# Altium schematic sheet 100068622_power_supplies.SchDoc
size 863 x 558 mm; SheetNumber: 5; SheetTotal: 6
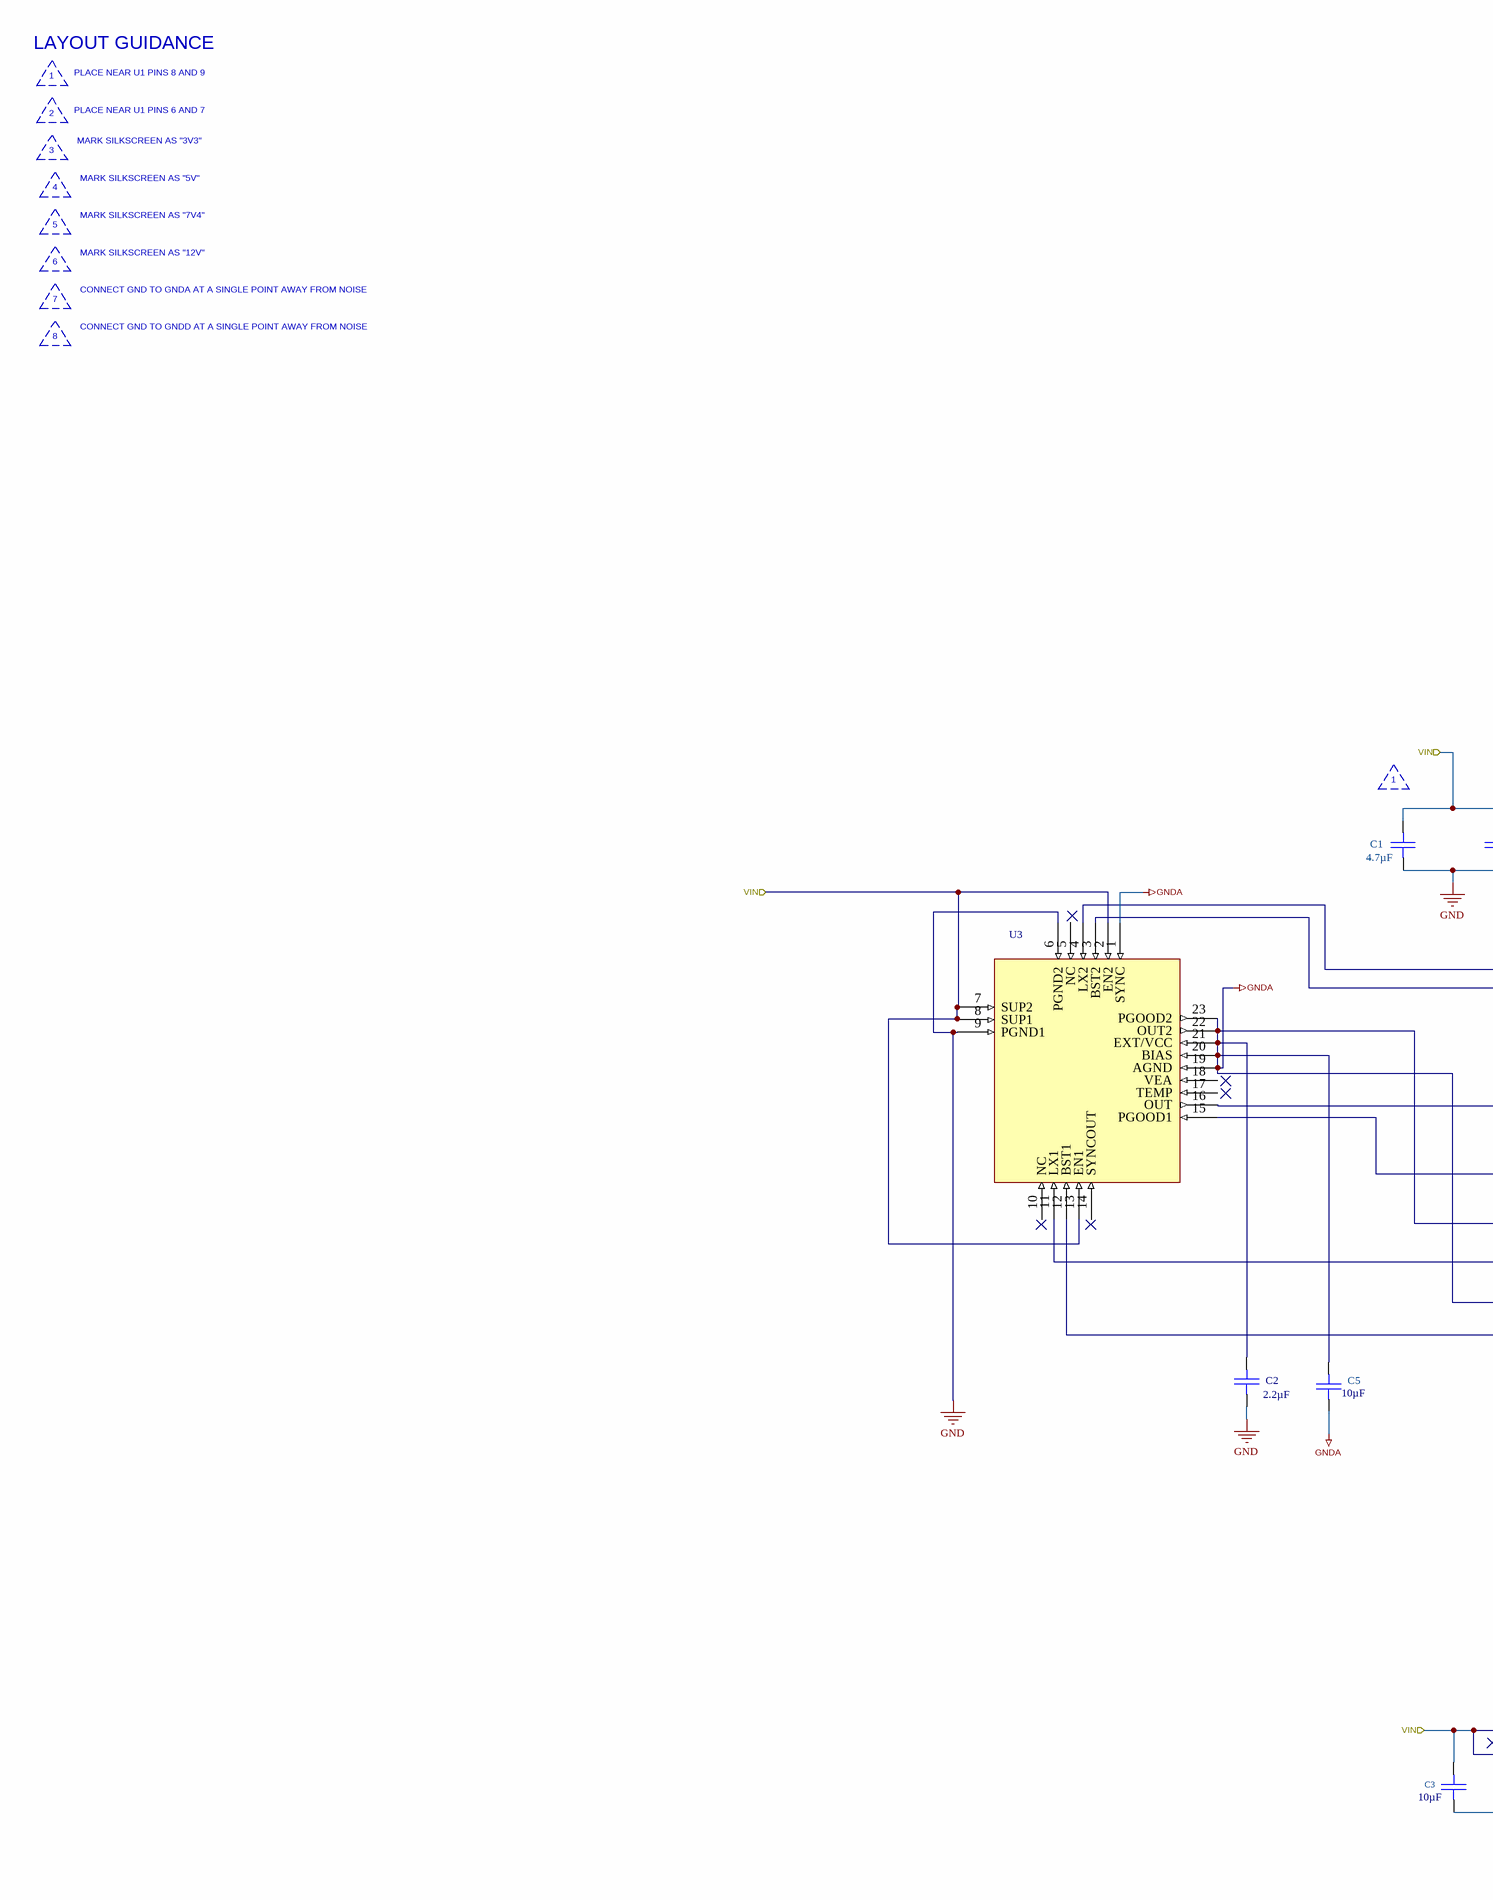
[diagram p0: 100068622_power_supplies.SchDoc, left]
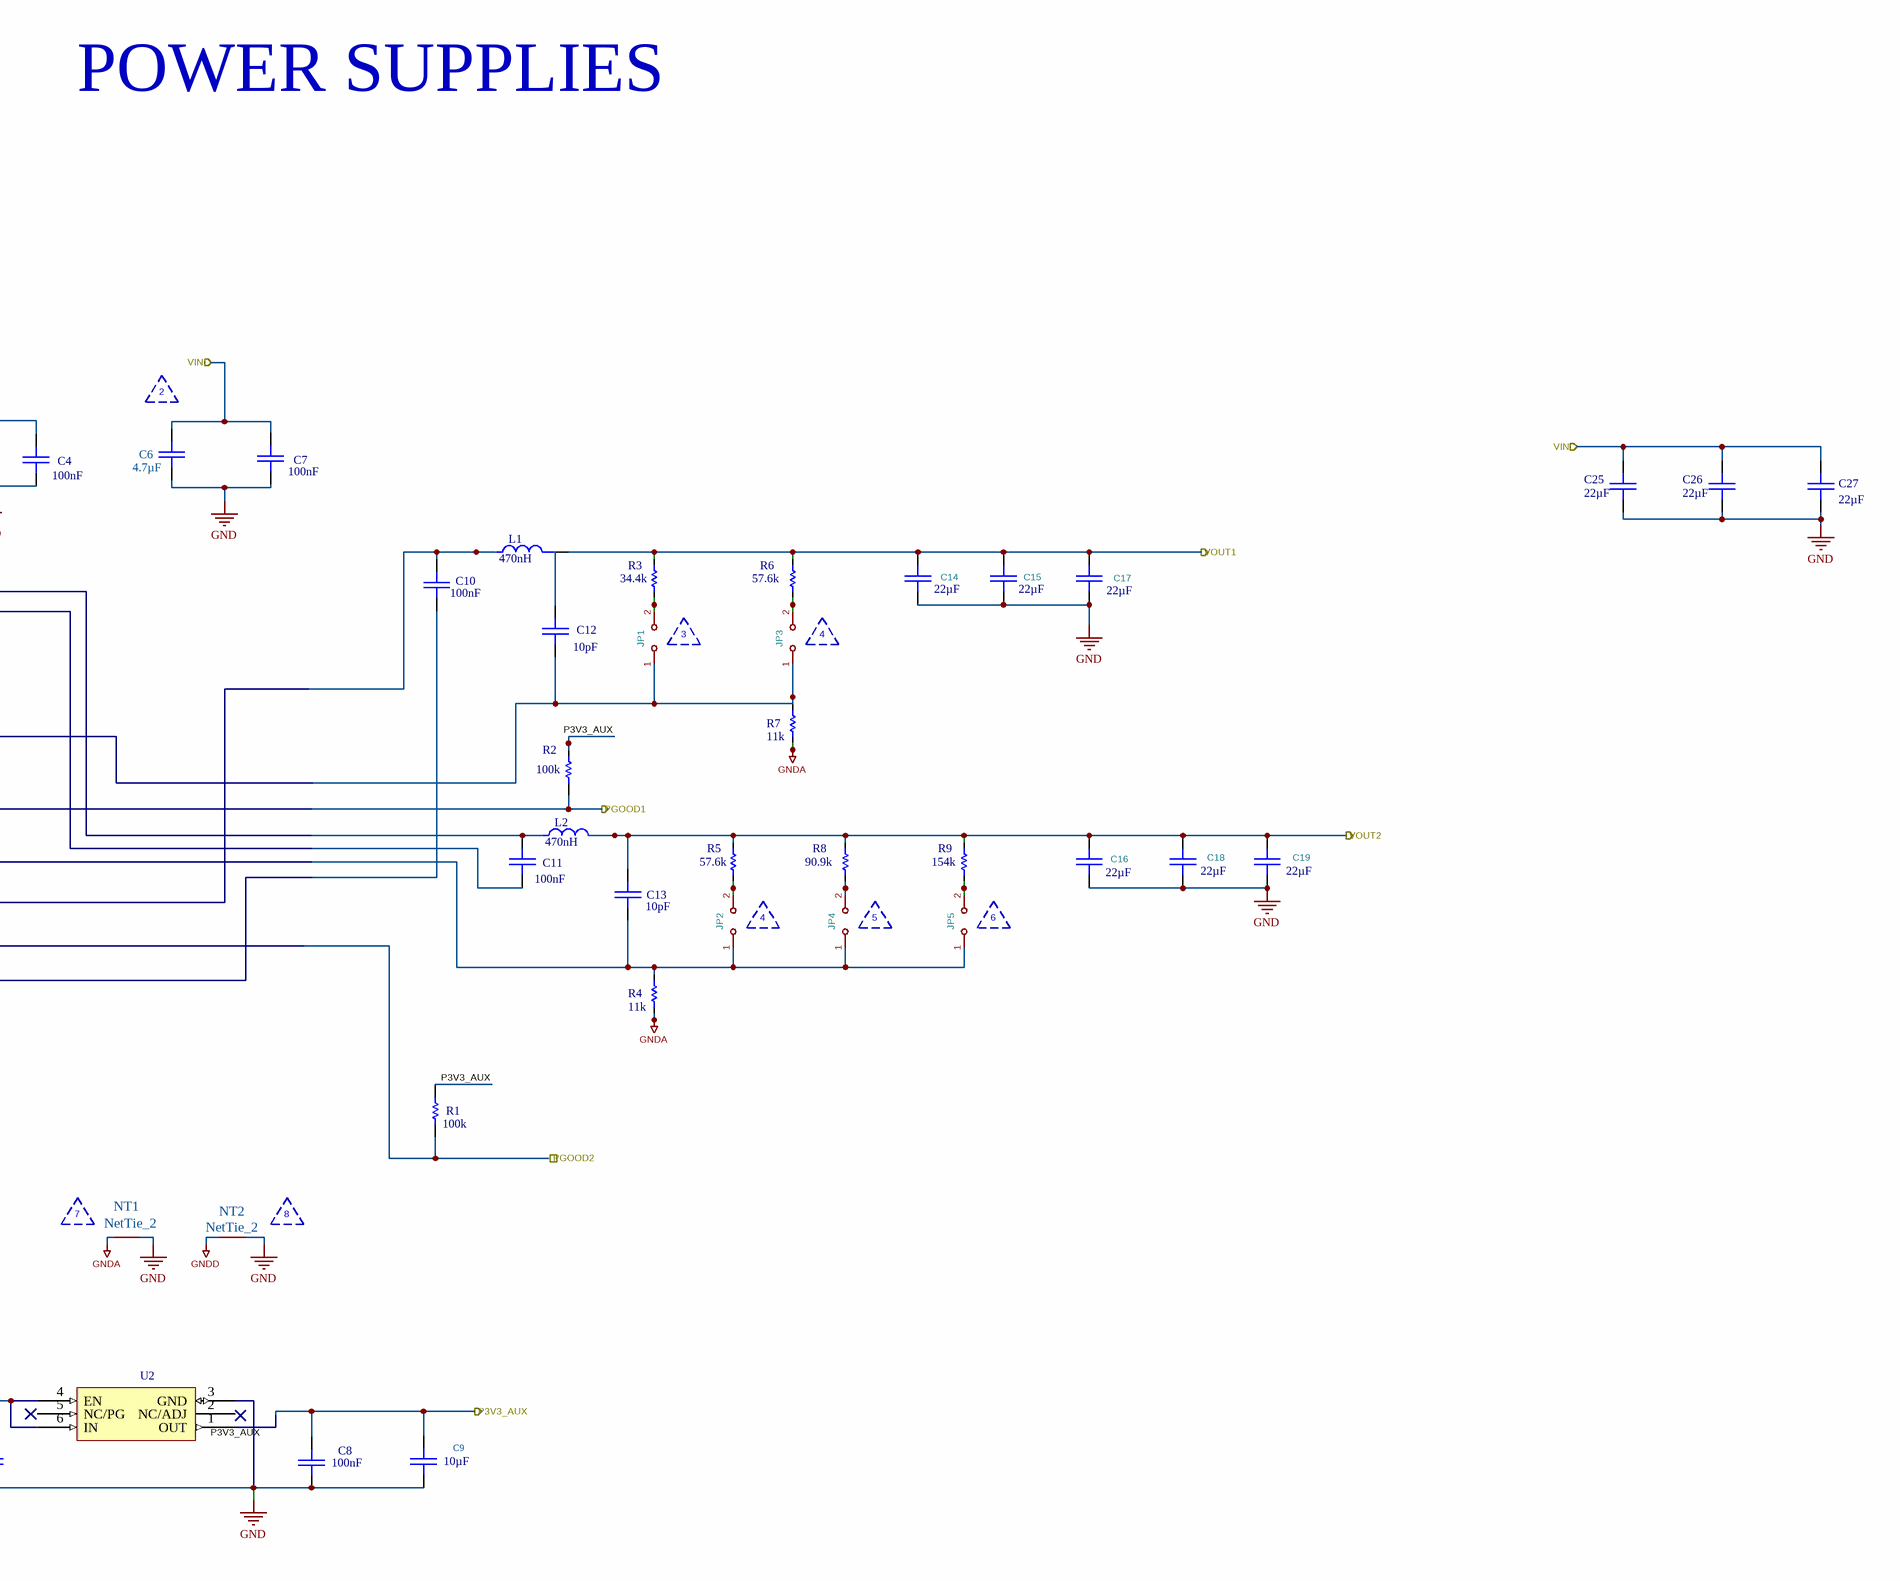
[diagram p1: 100068622_power_supplies.SchDoc, right]

## Parts
C1  value 4.7µF  [CAP-0805-A]  (hidden comment: CAP 0805 4.7UF 50V 10% X7R)
C2  value 2.2µF  [CAP-0402-A]  (hidden comment: CAP 0402 2.2UF 35V 10% X5R)
C3  value 10µF  [CAP-0805-A]  (hidden comment: CAP 0805 10UF 50V 10% X5R)
C4  value 100nF  [CAP-0402-A]  (hidden comment: CAP 0402 0.1UF 50V 10% X5R)
C5  value 10µF  [CAP-0402-A]  (hidden comment: Cap 0402 10uF 10V 20% X5R)
C6  value 4.7µF  [CAP-0805-A]  (hidden comment: CAP 0805 4.7UF 50V 10% X7R)
C7  value 100nF  [CAP-0402-A]  (hidden comment: CAP 0402 0.1UF 50V 10% X5R)
C8  value 100nF  [CAP-0402-A]  (hidden comment: CAP 0402 0.1UF 50V 10% X5R)
C9  value 10µF  [CAP-0402-A]  (hidden comment: Cap 0402 10uF 10V 20% X5R)
C10  value 100nF  [CAP-0402-A]  (hidden comment: CAP 0402 0.1UF 50V 10% X5R)
C11  value 100nF  [CAP-0402-A]  (hidden comment: CAP 0402 0.1UF 50V 10% X5R)
C12  value 10pF  [CAP-0402-A]  (hidden comment: CAP 0402 10pF 50V 2% NPO)
C13  value 10pF  [CAP-0402-A]  (hidden comment: CAP 0402 10pF 50V 2% NPO)
C14  value 22µF  [CAP-0805-A]  (hidden comment: Cap 0805 22uF 25V 20% X5R)
C15  value 22µF  [CAP-0805-A]  (hidden comment: Cap 0805 22uF 25V 20% X5R)
C16  value 22µF  [CAP-0805-A]  (hidden comment: Cap 0805 22uF 25V 20% X5R)
C17  value 22µF  [CAP-0805-A]  (hidden comment: Cap 0805 22uF 25V 20% X5R)
C18  value 22µF  [CAP-0805-A]  (hidden comment: Cap 0805 22uF 25V 20% X5R)
C19  value 22µF  [CAP-0805-A]  (hidden comment: Cap 0805 22uF 25V 20% X5R)
C25  value 22µF  [CAP-0805-A]  (hidden comment: CAP 0805 22UF 35V 20%)
C26  value 22µF  [CAP-0805-A]  (hidden comment: CAP 0805 22UF 35V 20%)
C27  value 22µF  [CAP-0805-A]  (hidden comment: CAP 0805 22UF 35V 20%)
JP1  Jumper_2_Bridged  [SolderJumper-2_P1.3mm_Open_TrianglePad1.0x1.5mm]  (value not drawn)
JP2  Jumper_2_Bridged  [SolderJumper-2_P1.3mm_Open_TrianglePad1.0x1.5mm]  (value not drawn)
JP3  Jumper_2_Open  [SolderJumper-2_P1.3mm_Open_TrianglePad1.0x1.5mm]  (value not drawn)
JP4  Jumper_2_Open  [SolderJumper-2_P1.3mm_Open_TrianglePad1.0x1.5mm]  (value not drawn)
JP5  Jumper_2_Open  [SolderJumper-2_P1.3mm_Open_TrianglePad1.0x1.5mm]  (value not drawn)
L1  value 470nH  [IND-1616-A]  (hidden comment: XEL4030-471MEC)
L2  value 470nH  [IND-1616-A]  (hidden comment: XEL4030-471MEC)
NT1  NetTie_2  [NetTie segment - 10 mils horizontal]
NT2  NetTie_2  [NetTie segment - 10 mils horizontal]
R1  value 100k  [RES-0402-C]  (hidden comment: Res 0402 100K 1/10W 1% Thick Flim)
R2  value 100k  [RES-0402-C]  (hidden comment: Res 0402 100K 1/10W 1% Thick Flim)
R3  value 34.4k  [RES-0402-A]  (hidden comment: RES 0402 34.4K 1/16W 1%)
R4  value 11k  [RES-0402-C]  (hidden comment: RES 0402 11K 1/10W 1%)
R5  value 57.6k  [RES-0402-A]  (hidden comment: RES 0402 57.6K 1/10W 1%)
R6  value 57.6k  [RES-0402-A]  (hidden comment: RES 0402 57.6K 1/10W 1%)
R7  value 11k  [RES-0402-C]  (hidden comment: RES 0402 11K 1/10W 1%)
R8  value 90.9k  [RES-0402-A]  (hidden comment: RES 0402 90.9K 1/10W 1%)
R9  value 154k  [RES-0402-A]  (hidden comment: Res 0402 154K 1/10W 1% Thick Flim)
U2  NCP730BMT330TBG  [IC-WDFN6-B]  (value not drawn)
U3  MAX25254AFDE_VY+  [IC-FC2QFN23-A]  (value not drawn)

## Ports
P3V3_AUX (out), PGOOD1 (out), PGOOD2 (out), VIN (in), VOUT1 (out), VOUT2 (out)

## Nets
GND: C1.1 C2.1 C3.1 C4.1 C6.1 C7.1 C8.1 C9.1 C14.1 C15.1 C16.1 C17.1 C18.1 C19.1 C25.1 C26.1 C27.1 NT1.2 NT2.2 U2.3(GND) U3.6(PGND2) U3.9(PGND1)
GNDA: C2.2 C5.1 C5.2 C13.1 JP2.1(A) JP4.1(A) JP5.1(A) NT1.1 R1.2 R4.1 R4.2 R7.1 U3.1(SYNC) U3.19(AGND) U3.20(BIAS) U3.21(EXT/VCC) U3.22(OUT2) U3.23(PGOOD2)
GNDD: NT2.1
P3V3_AUX: C8.2 C9.2 U2.1(OUT) ; port P3V3_AUX
P3V3_AUX: R1.1 R2.2  [a separate net that carries the same name]
PGOOD1: R2.1 U3.15(PGOOD1) ; port PGOOD1
VIN: C1.2 C3.2 C4.2 C6.2 C7.2 C25.2 C26.2 C27.2 U2.4(EN) U2.6(IN) U3.2(EN2) U3.7(SUP2) U3.8(SUP1) U3.13(EN1) ; port VIN
VOUT1: C14.2 C15.2 C17.2 L1.2 R3.2 R6.2 ; port VOUT1
VOUT2: C13.2 C16.2 C18.2 C19.2 L2.2 R5.2 R8.2 R9.2 ; port VOUT2
NetC10_1: C10.1 U3.12(BST1)
NetC10_2: C10.2 L1.1 U3.11(LX1)
NetC11_1: C11.1 U3.3(BST2)
NetC11_2: C11.2 L2.1 U3.4(LX2)
NetC12_1: C12.1 JP1.1(A) JP3.1(A) R7.2 U3.16(OUT)
NetJP1_2: JP1.2(B) R3.1
NetJP2_2: JP2.2(B) R5.1
NetJP3_2: JP3.2(B) R6.1
NetJP4_2: JP4.2(B) R8.1
NetJP5_2: JP5.2(B) R9.1

Not connected (* = marked no-connect by the designer): C12 2; U2 2(NC/ADJ) 5(NC/PG); U3 5(NC) 10(NC) 14(SYNCOUT) 17(TEMP) 18(VEA)

## Notes on the sheet
- LAYOUT GUIDANCE
- 1
- PLACE NEAR U1 PINS 8 AND 9
- 2
- 3
- PLACE NEAR U1 PINS 6 AND 7
- MARK SILKSCREEN AS "3V3"
- 4
- MARK SILKSCREEN AS "5V"
- MARK SILKSCREEN AS "7V4"
- 6
- 5
- MARK SILKSCREEN AS "12V"
- 8
- 7
- CONNECT GND TO GNDA AT A SINGLE POINT AWAY FROM NOISE
- CONNECT GND TO GNDD AT A SINGLE POINT AWAY FROM NOISE
- POWER SUPPLIES
- (near C1) 1
- (near C6) 2
- (near JP1) 3
- (near JP3) 4
- (near JP2) 4
- (near JP4) 5
- (near JP5) 6
- (near NT1) 7
- Labels drawn without touching a wire or pin: P3V3_AUX
- DWG NO
- REVISIONS
- SH
- REVISION
- DESCRIPTION
- DATE(YEAR-MO-DA)
- APPROVED
- PART NO.
- DESIGN ACTIVITY
- US ARMY
  COMBAT CAPABILITIES DEVELOPMENT COMMAND ARMAMENTS CENTER
  PICATINNY ARSENAL, NEW JERSEY 07806-5000
- SIZE
- CAGE CODE
- DWG NO.
- D
- 19200
- SCALE
- NONE
- UNIT WT.
- ---
- SHEET

## Library data of the parts
C1 C6 = CAP-00372-1: Leader Qty: 100; UOM: EA; Footprint: Capacitor_SMD:C_0805_2012Metric; Case/Package: 0805; Max Operating Temperature: 125°C; Min Operating Temperature: -55°C; Mounting Technology: Surface Mount; Voltage Rating: 50V
C2 = CAP-00383-1: Capacitor Type: Ceramic; Leader Qty: 100; UOM: EA; Footprint: Capacitor_SMD:C_0402_1005Metric; Case/Package: 0402; Max Operating Temperature: 85°C; Min Operating Temperature: -55°C; Mounting Technology: Surface Mount; Pins: 2; RoHS Compliant: Yes; Tolerance: 10%; Voltage Rating: 35V
C3 = CAP-00370-1: Leader Qty: 100; UOM: EA; Footprint: Capacitor_SMD:C_0805_2012Metric; Case/Package: 0805; Dielectric: X5R; Max Operating Temperature: 85°C; Min Operating Temperature: -55°C; Mounting Technology: Surface Mount
C4 C7 C8 C10 C11 = CAP-00349-1: Capacitor Type: Ceramic; Leader Qty: 100; UOM: EA; Footprint: Capacitor_SMD:C_0402_1005Metric; Case/Package: 0402; Max Operating Temperature: 85°C; Min Operating Temperature: -55°C; Mounting Technology: Surface Mount; Pins: 2; RoHS Compliant: Yes; Tolerance: 10%; Voltage Rating: 50V
C5 C9 = CAP-00021-6: Capacitor Type: Ceramic; Leader Qty: 100; Footprint: Capacitor_SMD:C_0402_1005Metric; Case/Package: 0402; Max Operating Temperature: 85°C; Min Operating Temperature: -55°C; Mounting Technology: SMT; Pins: 2; RoHS Compliant: Yes; Tolerance: 20%; Voltage Rating: 10V
C12 C13 = CAP-00136-5: Cap Ceramic 10pF 50V C0G 2% Pad SMD 0402 125°C T/R; Leader Qty: 100; Footprint: Capacitor_SMD:C_0402_1005Metric; Case/Package: 0402; Max Operating Temperature: 125°C; Min Operating Temperature: -55°C; RoHS Compliant: Yes; Tolerance: 2%; Voltage Rating: 50V
C14-C19 = CMP-00053-15: Capacitor Type: Ceramic; Leader Qty: 100; Footprint: Capacitor_SMD:C_0805_2012Metric; Case/Package: 0805; Max Operating Temperature: 85°C; Min Operating Temperature: -55°C; Mounting Technology: Surface Mount; Series: -; Tolerance: 20%; Voltage Rating: 25V
C25-C27 = CAP-00374-1: Leader Qty: 100; Material: Ceramic; UOM: EA; Footprint: Capacitor_SMD:C_0805_2012Metric; Case/Package: 0805; Length: 2mm; Max Length: 2.2mm; Max Operating Temperature: 85°C; Min Operating Temperature: -55°C; Mounting Technology: Surface Mount; Tolerance: 20%; Voltage Rating: 35V
L1 L2 = CMP-00659-1: General Purpose Inductor, 0.47uH, 20%, 1 Element, Composite-Core, SMD, 1616; DC Resistance (DCR): 4.6mΩ; Max Current Rating: 15.6A; Number of Circuits: 1; Self Resonant Frequency: 95MHz; Test Frequency: 1MHz; Footprint: 1a_Misc:XEL4030-3.1mm; Case/Package: 1616; Core Material: Composite; Country of Origin: Mainland China; Export Control Classification Number (ECCN) Code: EAR99; Harmonized Tariff Schedule (HTS) Code: 8504.50.80.00; Height: 3.1mm; Introduction Date: 2016-01-23; Lifecycle Status: Production; Max Operating Temperature: 125°C; Min Operating Temperature: -40°C; Number of Terminals: 2; REACH SVHC: Yes; RoHS: Compliant; Tolerance: 20%; Width: 4mm
R1 R2 = RES-00031-9: Leader Qty: 100; Footprint: Resistor_SMD:R_0402_1005Metric; Case/Package: 0402; Max Operating Temperature: 155°C; Min Operating Temperature: -55°C; Mounting Technology: SMT; Pins: 2; RoHS Compliant: Yes; Tolerance: 1%
R3 = RES-00791-1: Leader Qty: 100; UOM: EA; Voltage Rating: 50V; Footprint: Resistor_SMD:R_0402_1005Metric; Case/Package: 0402; Max Operating Temperature: 155°C; Min Operating Temperature: -55°C; Mounting Technology: Surface Mount; Tolerance: 1%
R4 R7 = RES-00793-1: Leader Qty: 100; Power Dissipation: 100mW; UOM: EA; Voltage Rating: 75V; Footprint: Resistor_SMD:R_0402_1005Metric; Case/Package: 0402; Case Code (Imperial): 0402; Height: 350µm; Length: 1mm; Lifecycle Status: Production; Max Operating Temperature: 155°C; Min Operating Temperature: -55°C; Mounting Technology: Surface Mount; Power Rating: 100mW; Termination: SMD/SMT; Tolerance: 1%; Working Voltage: 75V
R5 R6 = RES-00794-1: Leader Qty: 100; UOM: EA; Voltage Rating (DC): 50V; Footprint: Resistor_SMD:R_0402_1005Metric; Case/Package: 0402; Case Code (Imperial): 0402; Height: 350µm; Length: 1mm; Lifecycle Status: Production; Max Operating Temperature: 155°C; Min Operating Temperature: -55°C; Mounting Technology: Surface Mount; Tolerance: 1%; Voltage Rating: 50V
R8 = RES-00795-1: Leader Qty: 100; UOM: EA; Voltage Rating: 75V; Footprint: Resistor_SMD:R_0402_1005Metric; Case/Package: 0402; Case Code (Imperial): 0402; Max Operating Temperature: 155°C; Min Operating Temperature: -55°C; Mounting Technology: Surface Mount; Tolerance: 1%; Working Voltage: 75V
R9 = RES-00028-9: Leader Qty: 100; Footprint: Resistor_SMD:R_0402_1005Metric; Case/Package: 0402; Max Operating Temperature: 155°C; Min Operating Temperature: -55°C; Mounting Technology: SMT; Pins: 2; RoHS Compliant: Yes; Tolerance: 1%
U2 = IC-00416-1: LDO Regulator, 150 mA, 38 V, 1 uA IQ, with PG 3V3 HZ, WDFN6 2x2; Manufacturer Lifecycle Status: ACTIVE; Accuracy: 1%; Dropout Voltage: 290mV; Max Junction Temperature (Tj): 125°C; Max Supply Voltage: 38V; Min Input Voltage: 4.3V; Number of Channels: 1; Output Current: 150mA; Output Voltage: 3.3V; Voltage Tolerance: 2%; Footprint: 1a_Misc:WDFN6_2x2_0.65p_1.72x1.12mm_EP; China RoHS: Compliant; Export Control Classification Number (ECCN) Code: EAR99; Harmonized Tariff Schedule (HTS) Code: 8542.39.00.60; Height - Seated (Max): 800µm; Height: 800µm; Introduction Date: 2019-11-13; Length: 2mm; Lifecycle Status: Production; Max Operating Temperature: 150°C; Min Supply Voltage: 4.3V; Number of Circuits: 1; Number of Outputs: 1; Number of Terminals: 6; REACH SVHC: Yes; RoHS: Compliant; Terminal Pitch: 650µm; Width: 2mm
U3 = CMP-00667-1: Dual 36V Input Voltage, 8A Synchronous Buck Converters with Multiphase Capability and ASIL B Safety Level; Manufacturer Lifecycle Status: PRODUCTION; Footprint: 1a_Misc:F234A5FY+1; Lifecycle Status: Production
JP1 JP2 = Jumper_2_Bridged: Value: Jumper_2_Bridged; Footprint: Jumper:SolderJumper-2_P1.3mm_Open_TrianglePad1.0x1.5mm
JP3-JP5 = Jumper_2_Open: Value: Jumper_2_Open; Footprint: Jumper:SolderJumper-2_P1.3mm_Open_TrianglePad1.0x1.5mm
NT1 NT2 = NetTie_2: Value: NetTie_2; Footprint: 1a_Misc:NetTie segment - 10 mils horizontal